# EasyEDA schematic Battery_protection.json
TITLE: Sheet_1; REV: 1.0; Date: 2023-09-07; Sheet: 1/1; Drawn By: nicolas.schmid.6035; Company: Your Company
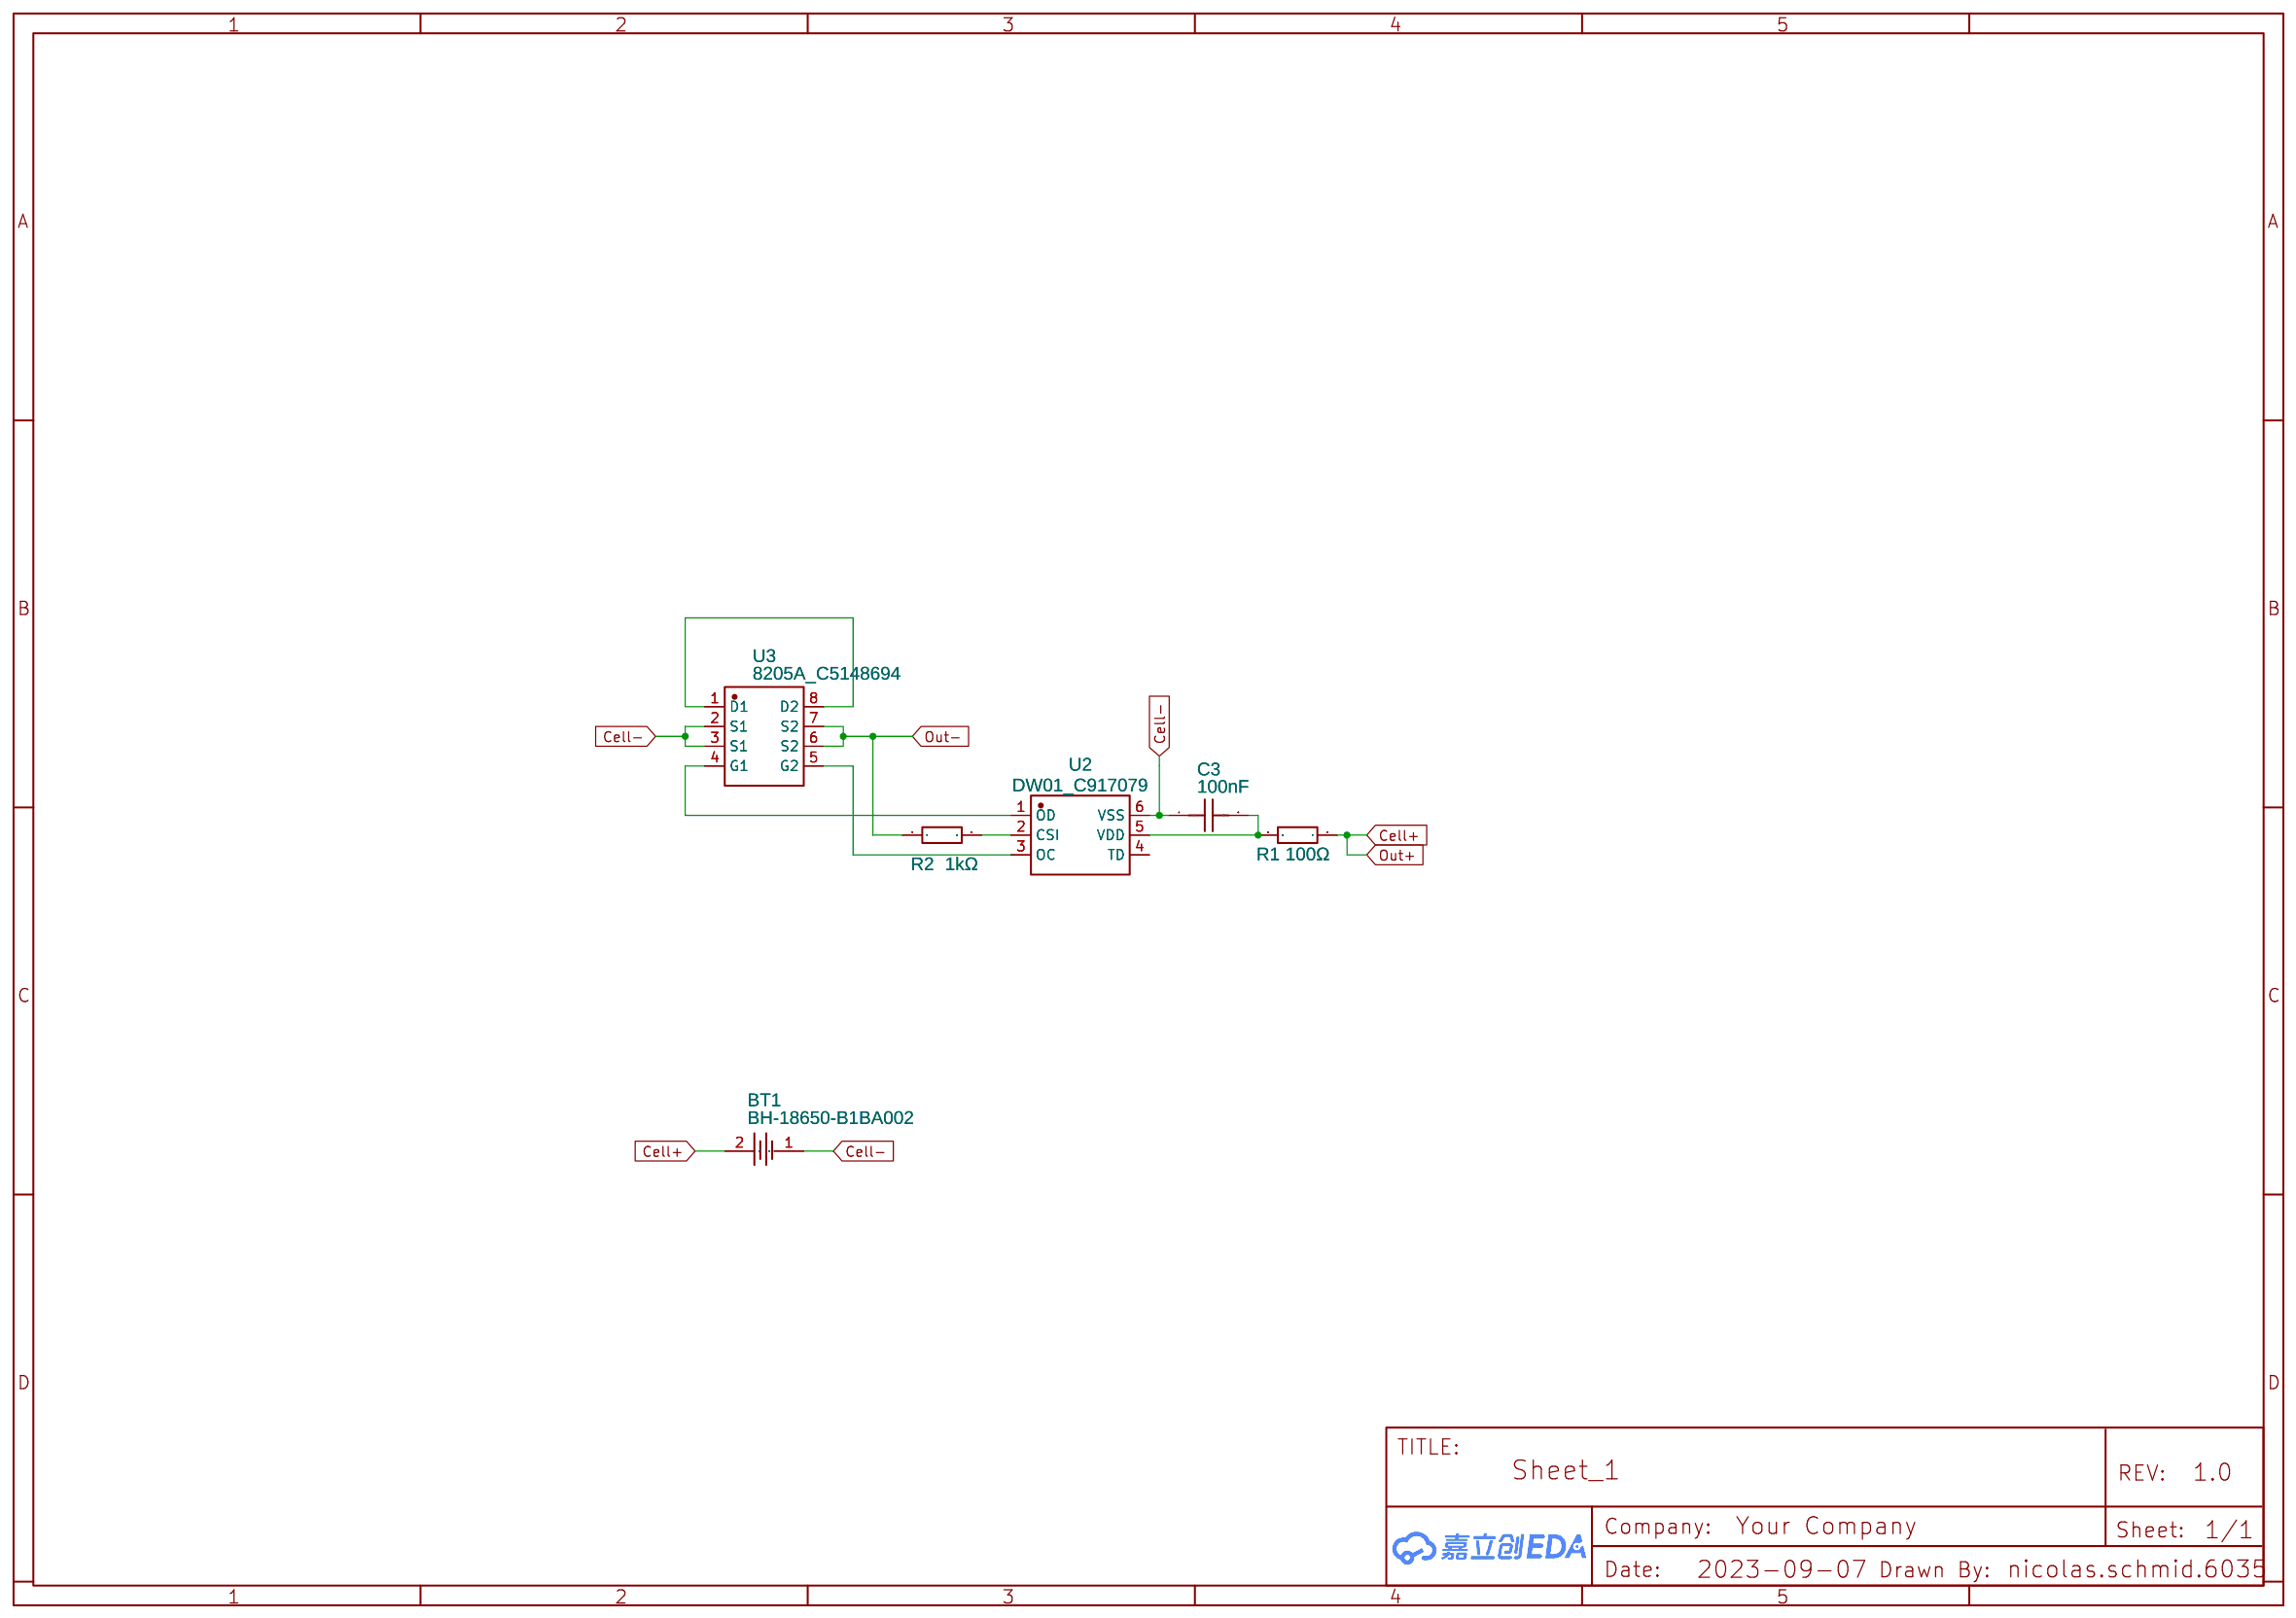
[diagram p0: schematic sheet]

## Parts
BT1  BH-18650-B1BA002  [BATTERY-SMD_18650-1S-L77.1-W20.7-1]
C3  100nF  [C0402]
R1  100Ω  [R1206]
R2  1kΩ  [R1206]
U2  DW01_C917079  [SOT-23-6_L2.9-W1.6-P0.95-LS2.8-BL]
U3  8205A_C5148694  [TSSOP-8_L4.4-W3.0-P0.65-LS6.4-BL]

## Library data of the parts
BT1 = BH-18650-B1BA002: Contributor: lcsc; Supplier: LCSC; Supplier Part: C2988620; Manufacturer: MYOUNG(美阳); JLCPCB Part Class: Extended Part
C3 = CL05B104KB54PNC: Contributor: LCSC; Supplier: LCSC; Supplier Part: C307331; Manufacturer: SAMSUNG(三星); JLCPCB Part Class: Basic Part
R1 = 1206W4F1000T5E: Supplier: LCSC; Manufacturer: UNI-ROYAL(厚声); Supplier Part: C17901; JLCPCB Part Class: Basic Part
R2 = 1206W4F1001T5E: Supplier: LCSC; Manufacturer: UNI-ROYAL(厚声); Supplier Part: C4410; JLCPCB Part Class: Basic Part
U2 = DW01_C917079: Contributor: LCSC; Supplier: LCSC; Supplier Part: C917079; Manufacturer: JSMSEMI(杰盛微); JLCPCB Part Class: Extended Part
U3 = 8205A_C5148694: Contributor: lcsc; Supplier: LCSC; Supplier Part: C5148694; Manufacturer: HXY MOSFET(华轩阳电子); JLCPCB Part Class: Extended Part

## Nets
Cell+: BT1.2 R1.1
Cell-: BT1.1 C3.1 U2.6(VSS) U3.2(S1) U3.3(S1)
Out-: R2.1 U3.6(S2) U3.7(S2)
Net-(C3-2): C3.2 R1.2 U2.5(VDD)
Net-(R2-2): R2.2 U2.2(CSI)
Net-(U2-1): U2.1(OD) U3.4(G1)
Net-(U2-3): U2.3(OC) U3.5(G2)
Net-(U3-1): U3.1(D1) U3.8(D2)

Not connected (* = marked no-connect by the designer): U2 4(TD)
